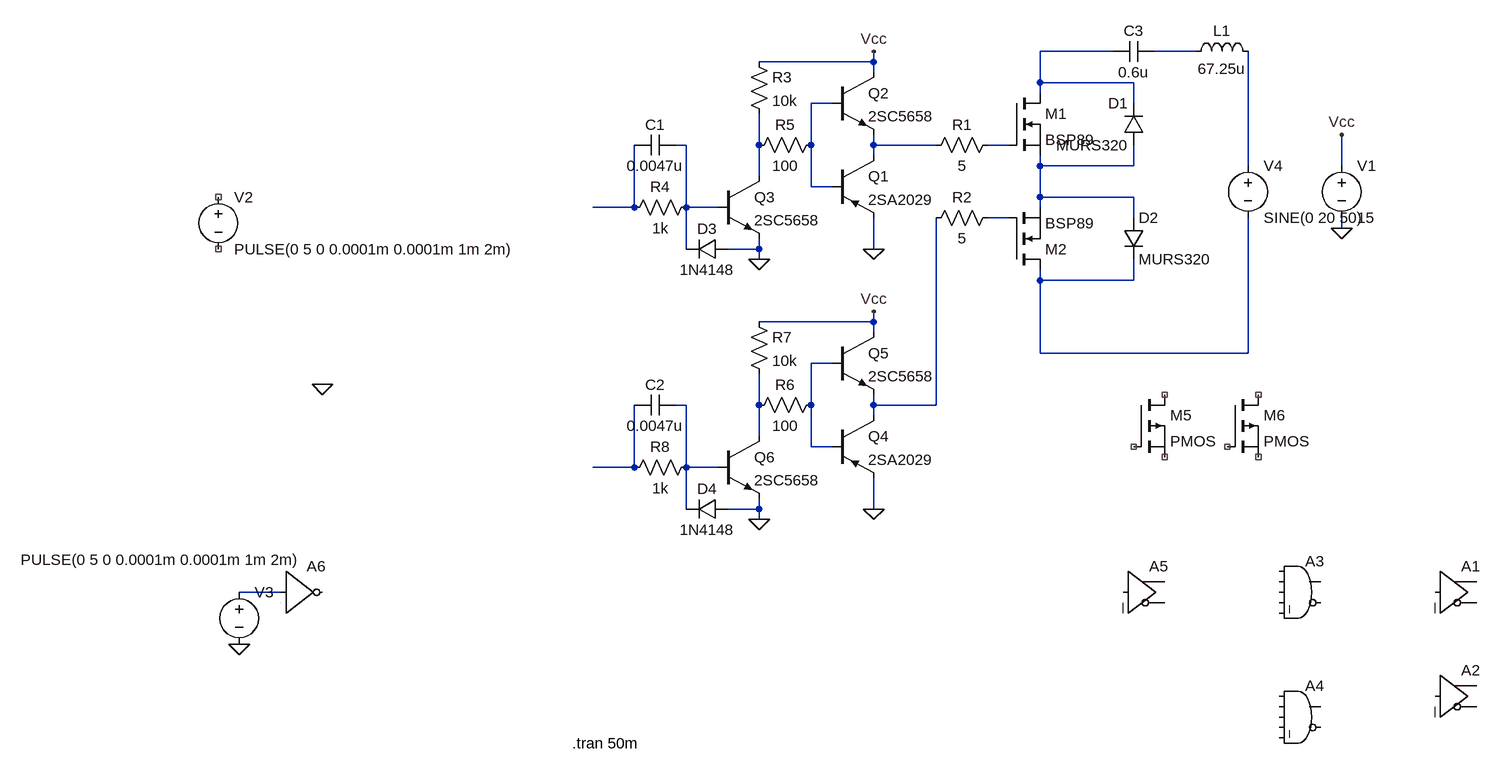
[diagram p0: schematic ACAC直接変換3.asc]
ACAC直接変換3.asc, the LTspice schematic file:
Version 4
SHEET 1 880 680
WIRE -400 -688 -512 -688
WIRE -272 -688 -336 -688
WIRE -768 -672 -768 -688
WIRE -768 -672 -944 -672
WIRE -768 -656 -768 -672
WIRE -512 -640 -512 -688
WIRE -368 -640 -512 -640
WIRE -512 -624 -512 -640
WIRE -832 -608 -864 -608
WIRE -368 -608 -368 -640
WIRE -1056 -544 -1072 -544
WIRE -944 -544 -944 -592
WIRE -864 -544 -864 -608
WIRE -768 -544 -768 -560
WIRE -672 -544 -768 -544
WIRE -560 -544 -592 -544
WIRE -768 -528 -768 -544
WIRE -512 -512 -512 -528
WIRE -368 -512 -368 -544
WIRE -368 -512 -512 -512
WIRE -192 -512 -192 -688
WIRE -48 -512 -48 -560
WIRE -944 -496 -944 -544
WIRE -864 -480 -864 -544
WIRE -832 -480 -864 -480
WIRE -512 -464 -512 -512
WIRE -368 -464 -512 -464
WIRE -1136 -448 -1136 -544
WIRE -1136 -448 -1200 -448
WIRE -1056 -448 -1056 -544
WIRE -1008 -448 -1056 -448
WIRE -512 -448 -512 -464
WIRE -560 -432 -592 -432
WIRE -368 -432 -368 -464
WIRE -48 -416 -48 -432
WIRE -1056 -384 -1056 -448
WIRE -944 -384 -944 -400
WIRE -944 -384 -992 -384
WIRE -768 -384 -768 -432
WIRE -944 -368 -944 -384
WIRE -512 -336 -512 -352
WIRE -368 -336 -368 -368
WIRE -368 -336 -512 -336
WIRE -768 -272 -768 -288
WIRE -768 -272 -944 -272
WIRE -768 -256 -768 -272
WIRE -512 -224 -512 -336
WIRE -192 -224 -192 -432
WIRE -192 -224 -512 -224
WIRE -832 -208 -864 -208
WIRE -1056 -144 -1072 -144
WIRE -944 -144 -944 -192
WIRE -864 -144 -864 -208
WIRE -768 -144 -768 -160
WIRE -672 -144 -672 -432
WIRE -672 -144 -768 -144
WIRE -768 -128 -768 -144
WIRE -944 -96 -944 -144
WIRE -864 -80 -864 -144
WIRE -832 -80 -864 -80
WIRE -1136 -48 -1136 -144
WIRE -1136 -48 -1200 -48
WIRE -1056 -48 -1056 -144
WIRE -1008 -48 -1056 -48
WIRE -1056 16 -1056 -48
WIRE -944 16 -944 0
WIRE -944 16 -992 16
WIRE -768 16 -768 -32
WIRE -944 32 -944 16
WIRE -1680 144 -1744 144
FLAG -768 -384 0
FLAG -48 -416 0
FLAG -48 -560 Vcc
FLAG -768 -688 Vcc
FLAG -944 -368 0
FLAG -1616 -176 0
FLAG -768 16 0
FLAG -768 -288 Vcc
FLAG -944 32 0
FLAG -1744 224 0
SYMBOL nmos -560 -624 R0
SYMATTR InstName M1
SYMATTR Value BSP89
SYMBOL nmos -560 -352 M180
SYMATTR InstName M2
SYMATTR Value BSP89
SYMBOL diode -352 -544 R180
WINDOW 0 24 64 Left 2
WINDOW 3 24 0 Left 2
SYMATTR InstName D1
SYMATTR Value MURS320
SYMBOL diode -384 -432 R0
SYMATTR InstName D2
SYMATTR Value MURS320
SYMBOL res -576 -560 R90
WINDOW 0 0 56 VBottom 2
WINDOW 3 32 56 VTop 2
SYMATTR InstName R1
SYMATTR Value 5
SYMBOL res -576 -448 R90
WINDOW 0 0 56 VBottom 2
WINDOW 3 32 56 VTop 2
SYMATTR InstName R2
SYMATTR Value 5
SYMBOL Digital\\and -112 80 R0
SYMATTR InstName A3
SYMBOL Digital\\and -112 272 R0
SYMATTR InstName A4
SYMBOL Digital\\buf 96 80 R0
SYMATTR InstName A1
SYMBOL Digital\\buf 96 240 R0
SYMATTR InstName A2
SYMBOL Digital\\buf -384 80 R0
SYMATTR InstName A5
SYMBOL pmos -368 -160 R0
SYMATTR InstName M5
SYMBOL pmos -224 -160 R0
SYMATTR InstName M6
SYMBOL voltage -48 -528 R0
WINDOW 123 0 0 Left 0
WINDOW 39 0 0 Left 0
SYMATTR InstName V1
SYMATTR Value 15
SYMBOL pnp -832 -528 R0
SYMATTR InstName Q1
SYMATTR Value 2SA2029
SYMBOL npn -832 -656 R0
SYMATTR InstName Q2
SYMATTR Value 2SC5658
SYMBOL res -848 -560 R90
WINDOW 0 0 56 VBottom 2
WINDOW 3 32 56 VTop 2
SYMATTR InstName R5
SYMATTR Value 100
SYMBOL res -960 -688 R0
SYMATTR InstName R3
SYMATTR Value 10k
SYMBOL res -1040 -464 R90
WINDOW 0 0 56 VBottom 2
WINDOW 3 32 56 VTop 2
SYMATTR InstName R4
SYMATTR Value 1k
SYMBOL npn -1008 -496 R0
SYMATTR InstName Q3
SYMATTR Value 2SC5658
SYMBOL diode -992 -400 R90
WINDOW 0 0 32 VBottom 2
WINDOW 3 32 32 VTop 2
SYMATTR InstName D3
SYMATTR Value 1N4148
SYMBOL cap -1072 -560 R90
WINDOW 0 0 32 VBottom 2
WINDOW 3 32 32 VTop 2
SYMATTR InstName C1
SYMATTR Value 0.0047u
SYMBOL voltage -1776 -480 R0
WINDOW 123 0 0 Left 0
WINDOW 39 0 0 Left 0
SYMATTR InstName V2
SYMATTR Value PULSE(0 5 0 0.0001m 0.0001m 1m 2m)
SYMBOL voltage -192 -528 R0
WINDOW 123 0 0 Left 0
WINDOW 39 0 0 Left 0
SYMATTR InstName V4
SYMATTR Value SINE(0 20 50)
SYMBOL ind -288 -672 R270
WINDOW 0 32 56 VTop 2
WINDOW 3 5 56 VBottom 2
SYMATTR InstName L1
SYMATTR Value 67.25u
SYMBOL cap -400 -672 R270
WINDOW 0 32 32 VTop 2
WINDOW 3 0 32 VBottom 2
SYMATTR InstName C3
SYMATTR Value 0.6u
SYMBOL pnp -832 -128 R0
SYMATTR InstName Q4
SYMATTR Value 2SA2029
SYMBOL npn -832 -256 R0
SYMATTR InstName Q5
SYMATTR Value 2SC5658
SYMBOL res -848 -160 R90
WINDOW 0 0 56 VBottom 2
WINDOW 3 32 56 VTop 2
SYMATTR InstName R6
SYMATTR Value 100
SYMBOL res -960 -288 R0
SYMATTR InstName R7
SYMATTR Value 10k
SYMBOL res -1040 -64 R90
WINDOW 0 0 56 VBottom 2
WINDOW 3 32 56 VTop 2
SYMATTR InstName R8
SYMATTR Value 1k
SYMBOL npn -1008 -96 R0
SYMATTR InstName Q6
SYMATTR Value 2SC5658
SYMBOL diode -992 0 R90
WINDOW 0 0 32 VBottom 2
WINDOW 3 32 32 VTop 2
SYMATTR InstName D4
SYMATTR Value 1N4148
SYMBOL cap -1072 -160 R90
WINDOW 0 0 32 VBottom 2
WINDOW 3 32 32 VTop 2
SYMATTR InstName C2
SYMATTR Value 0.0047u
SYMBOL voltage -1744 128 R0
WINDOW 123 0 0 Left 0
WINDOW 39 0 0 Left 0
WINDOW 3 -336 -34 Left 2
SYMATTR InstName V3
SYMATTR Value PULSE(0 5 0 0.0001m 0.0001m 1m 2m)
SYMBOL Digital\\inv -1680 80 R0
SYMATTR InstName A6
SYMATTR SpiceLine Vhigh=5V Vlow=0V
TEXT -1232 376 Left 2 !.tran 50m

The netlist it stands for:
* ACAC直接変換3.asc
M1 N001 N007 N008 N008 BSP89
M2 N012 N011 N008 N008 BSP89
D1 N008 N001 MURS320
D2 N008 N012 MURS320
R1 N007 N006 5
R2 N011 N016 5
A3 0 0 0 0 0 0 0 0 AND
A4 0 0 0 0 0 0 0 0 AND
A1 0 0 0 0 0 0 0 0 BUF
A2 0 0 0 0 0 0 0 0 BUF
A5 0 0 0 0 0 0 0 0 BUF
M5 NC_01 NC_02 NC_03 NC_03 PMOS
M6 NC_04 NC_05 NC_06 NC_06 PMOS
V1 Vcc 0 15
Q1 N006 N003 0 0 2SA2029
Q2 Vcc N003 N006 0 2SC5658
R5 N003 N005 100
R3 Vcc N005 10k
R4 N004 N010 1k
Q3 N005 N004 0 0 2SC5658
D3 0 N004 1N4148
C1 N004 N010 0.0047u
V2 NC_07 NC_08 PULSE(0 5 0 0.0001m 0.0001m 1m 2m)
V4 N009 N012 SINE(0 20 50)
L1 N002 N009 67.25u
C3 N001 N002 0.6u
Q4 N016 N013 0 0 2SA2029
Q5 Vcc N013 N016 0 2SC5658
R6 N013 N015 100
R7 Vcc N015 10k
R8 N014 N017 1k
Q6 N015 N014 0 0 2SC5658
D4 0 N014 1N4148
C2 N014 N017 0.0047u
V3 N018 0 PULSE(0 5 0 0.0001m 0.0001m 1m 2m)
A6 N018 0 0 0 0 0 0 0 BUF Vhigh=5V Vlow=0V
.model D D
.lib standard.dio
.model NPN NPN
.model PNP PNP
.lib standard.bjt
.model NMOS NMOS
.model PMOS PMOS
.lib standard.mos
.tran 50m
.backanno
.end